# EAGLE design RJ-45 v1.1 (EAGLE 9.5.2)
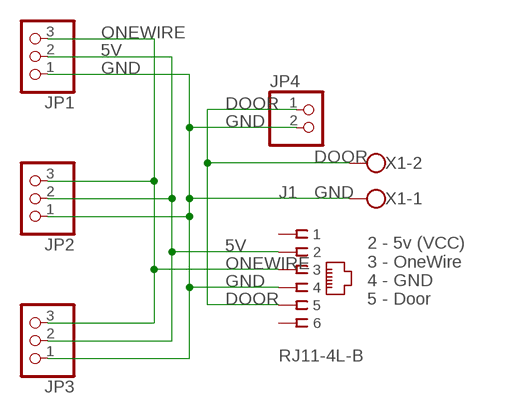
[diagram p0: schematic, sheet 1]

## Parts
J1  RJ11-4L-B  [RJ11-NO_SHIELD]
JP1  PINHD-1X3  [1X03]
JP2  PINHD-1X3  [1X03]
JP3  PINHD-1X3  [1X03]
JP4  PINHD-1X2  [1X02]
X1  W237-102  [W237-102]

## Nets
5V: J1.2 JP1.2 JP2.2 JP3.2
DOOR: J1.5 JP4.1 X1.2
GND: J1.4 JP1.1 JP2.1 JP3.1 JP4.2 X1.1
ONEWIRE: J1.3 JP1.3 JP2.3 JP3.3
Unconnected: J1.1 J1.6

## Notes on the sheet
- 2 - 5v (VCC)
  3 - OneWire
  4 - GND
  5 - Door

## Library data of the parts
J1 = con-tycoelectronics:RJ11: CORCOM Modular RJ Jacks No Shield Source: www.tycoelectronics.com .. ENG_DS_1654001_1099_RJ_L_0507.pdf; MF: TYCO ELECTRONICS; MPN: RJ11-4L-B; OC_FARNELL: unknown; OC_NEWARK: 52K3315
JP1-JP3 = pinhead:PINHD-1X3: PIN HEADER
JP4 = pinhead:PINHD-1X2: PIN HEADER
X1 = con-wago-500:W237-102: WAGO SCREW CLAMP; MPN: 237-102; OC_FARNELL: unknown; OC_NEWARK: 70K9898

## Board
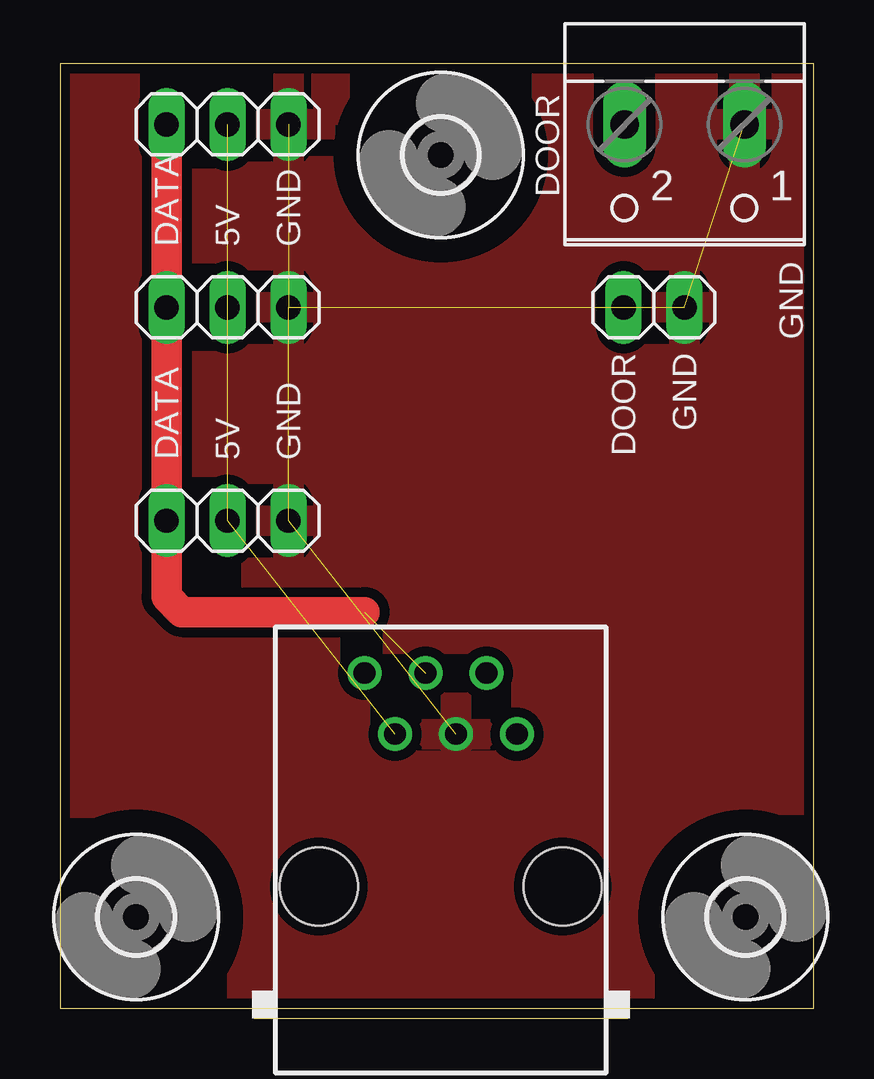
[diagram p1: board, top side]
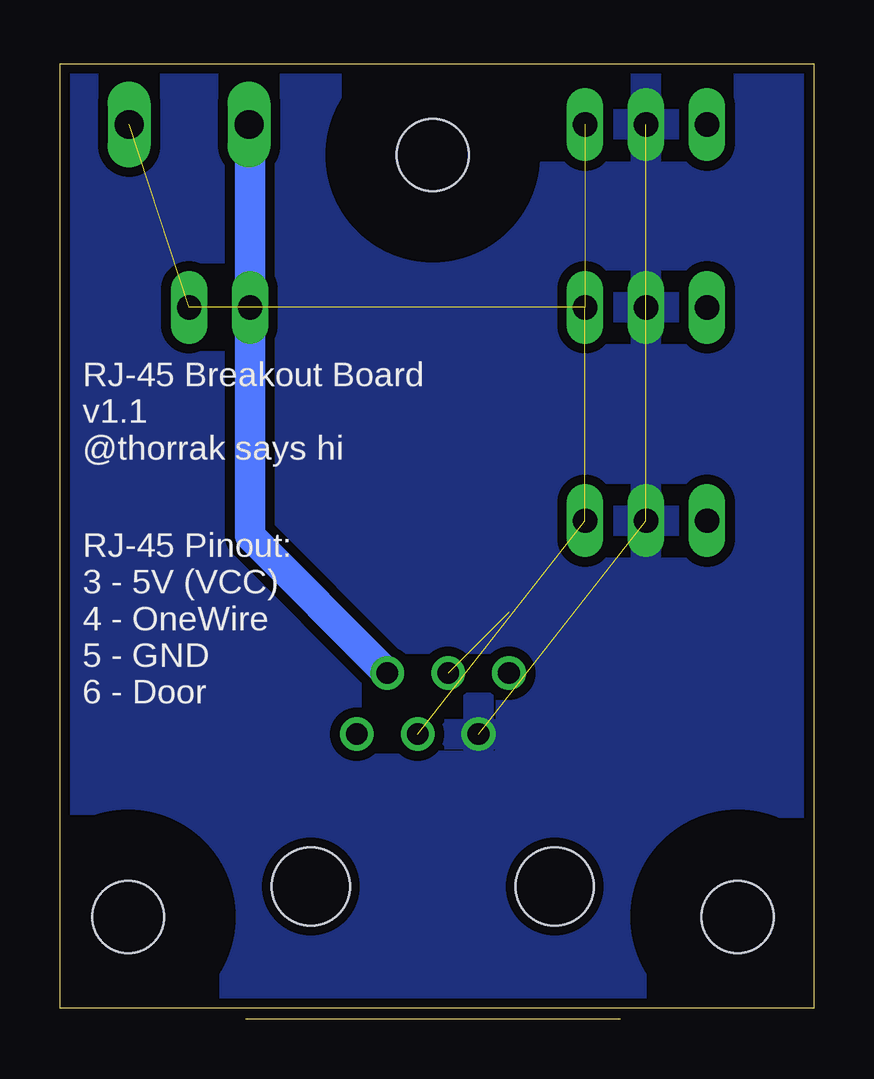
[diagram p2: board, bottom side, seen from below]

Size 31.42 x 39.36 mm. Coordinates in mm from the lower left corner, seen from the top.
Outline: 0,0 31.42,0 31.42,39.36 0,39.36 0,0
Copper layers (1*16): Top 0.0356mm / dielectric 1.5011mm / Bottom 0.0356mm
Design rules "PCBs_io": minimum track width 6mil, minimum drill 13mil, track to track 6mil, track to pad 6mil, pad to pad 6mil, via to via 6mil, smd to smd 6mil, copper to edge 15mil, drill to drill 6mil, minimum pad ring 7mil, minimum via ring 7mil, stop-mask expansion 3mil, vias tented up to drill 0mil, thermal gap 10mil

### Footprints (pad centres in the part's own frame; a part is rotated, then mirrored left to right if it is on the bottom)
RJ11-NO_SHIELD = drill 0.9 pad 1.4: 1 -3.175,8.89; 2 -1.905,6.35; 3 -0.635,8.89; 4 0.635,6.35; 5 1.905,8.89; 6 3.175,6.35 | hole 3.251: -5.08,0; 5.08,0
1X03 = drill 1.016 long: 1 -2.54,0; 2 0,0; 3 2.54,0
1X02 = drill 1.016 long: 1 -1.27,0; 2 1.27,0
3,0 = hole 3: 0,0
W237-102 = drill 1.194 long: 1 -2.5,-1.27; 2 2.5,-1.27

### Placement (x,y rotation side)
J1  15.88,5.08 0 top
JP1  6.98,20.32 180 top
JP2  6.98,29.21 180 top
JP3  6.98,36.83 180 top
JP4  24.77,29.21 0 top
U$1  [3,0]  28.57,3.81 0 top
U$2  [3,0]  3.17,3.81 0 top
U$3  [3,0]  15.88,35.56 0 top
X1  26.04,35.56 180 top

### Tracks (layer width: path | path; a pad name or v marks a point on that pad's centre or on a via)
5V  (3 unrouted)
  pour Bottom (isolate 0.406): 0,39.37 31.75,39.37 31.75,0 0,0
DOOR
  Bottom 1.27: X1.2 23.5,36.79 JP4.1 23.5,19.69 J1.5
GND  (5 unrouted)
  pour Top (isolate 0.406): 0,39.37 31.75,39.37 31.75,0 0,0
ONEWIRE  (1 unrouted)
  Top 1.27: JP3.3 JP2.3 JP1.3 4.45,17.14 5.08,16.51 12.7,16.51

### Text on the board
tNames: DOOR | DATA | 5V | GND | GND | DOOR | GND | DATA | 5V | GND
bNames: RJ-45 Breakout Board / v1.1 / @thorrak says hi | RJ-45 Pinout: / 3 - 5V (VCC) / 4 - OneWire / 5 - GND / 6 - Door